# EAGLE board serv_open8_rohm (EAGLE 9.6.2), part 1 of 2
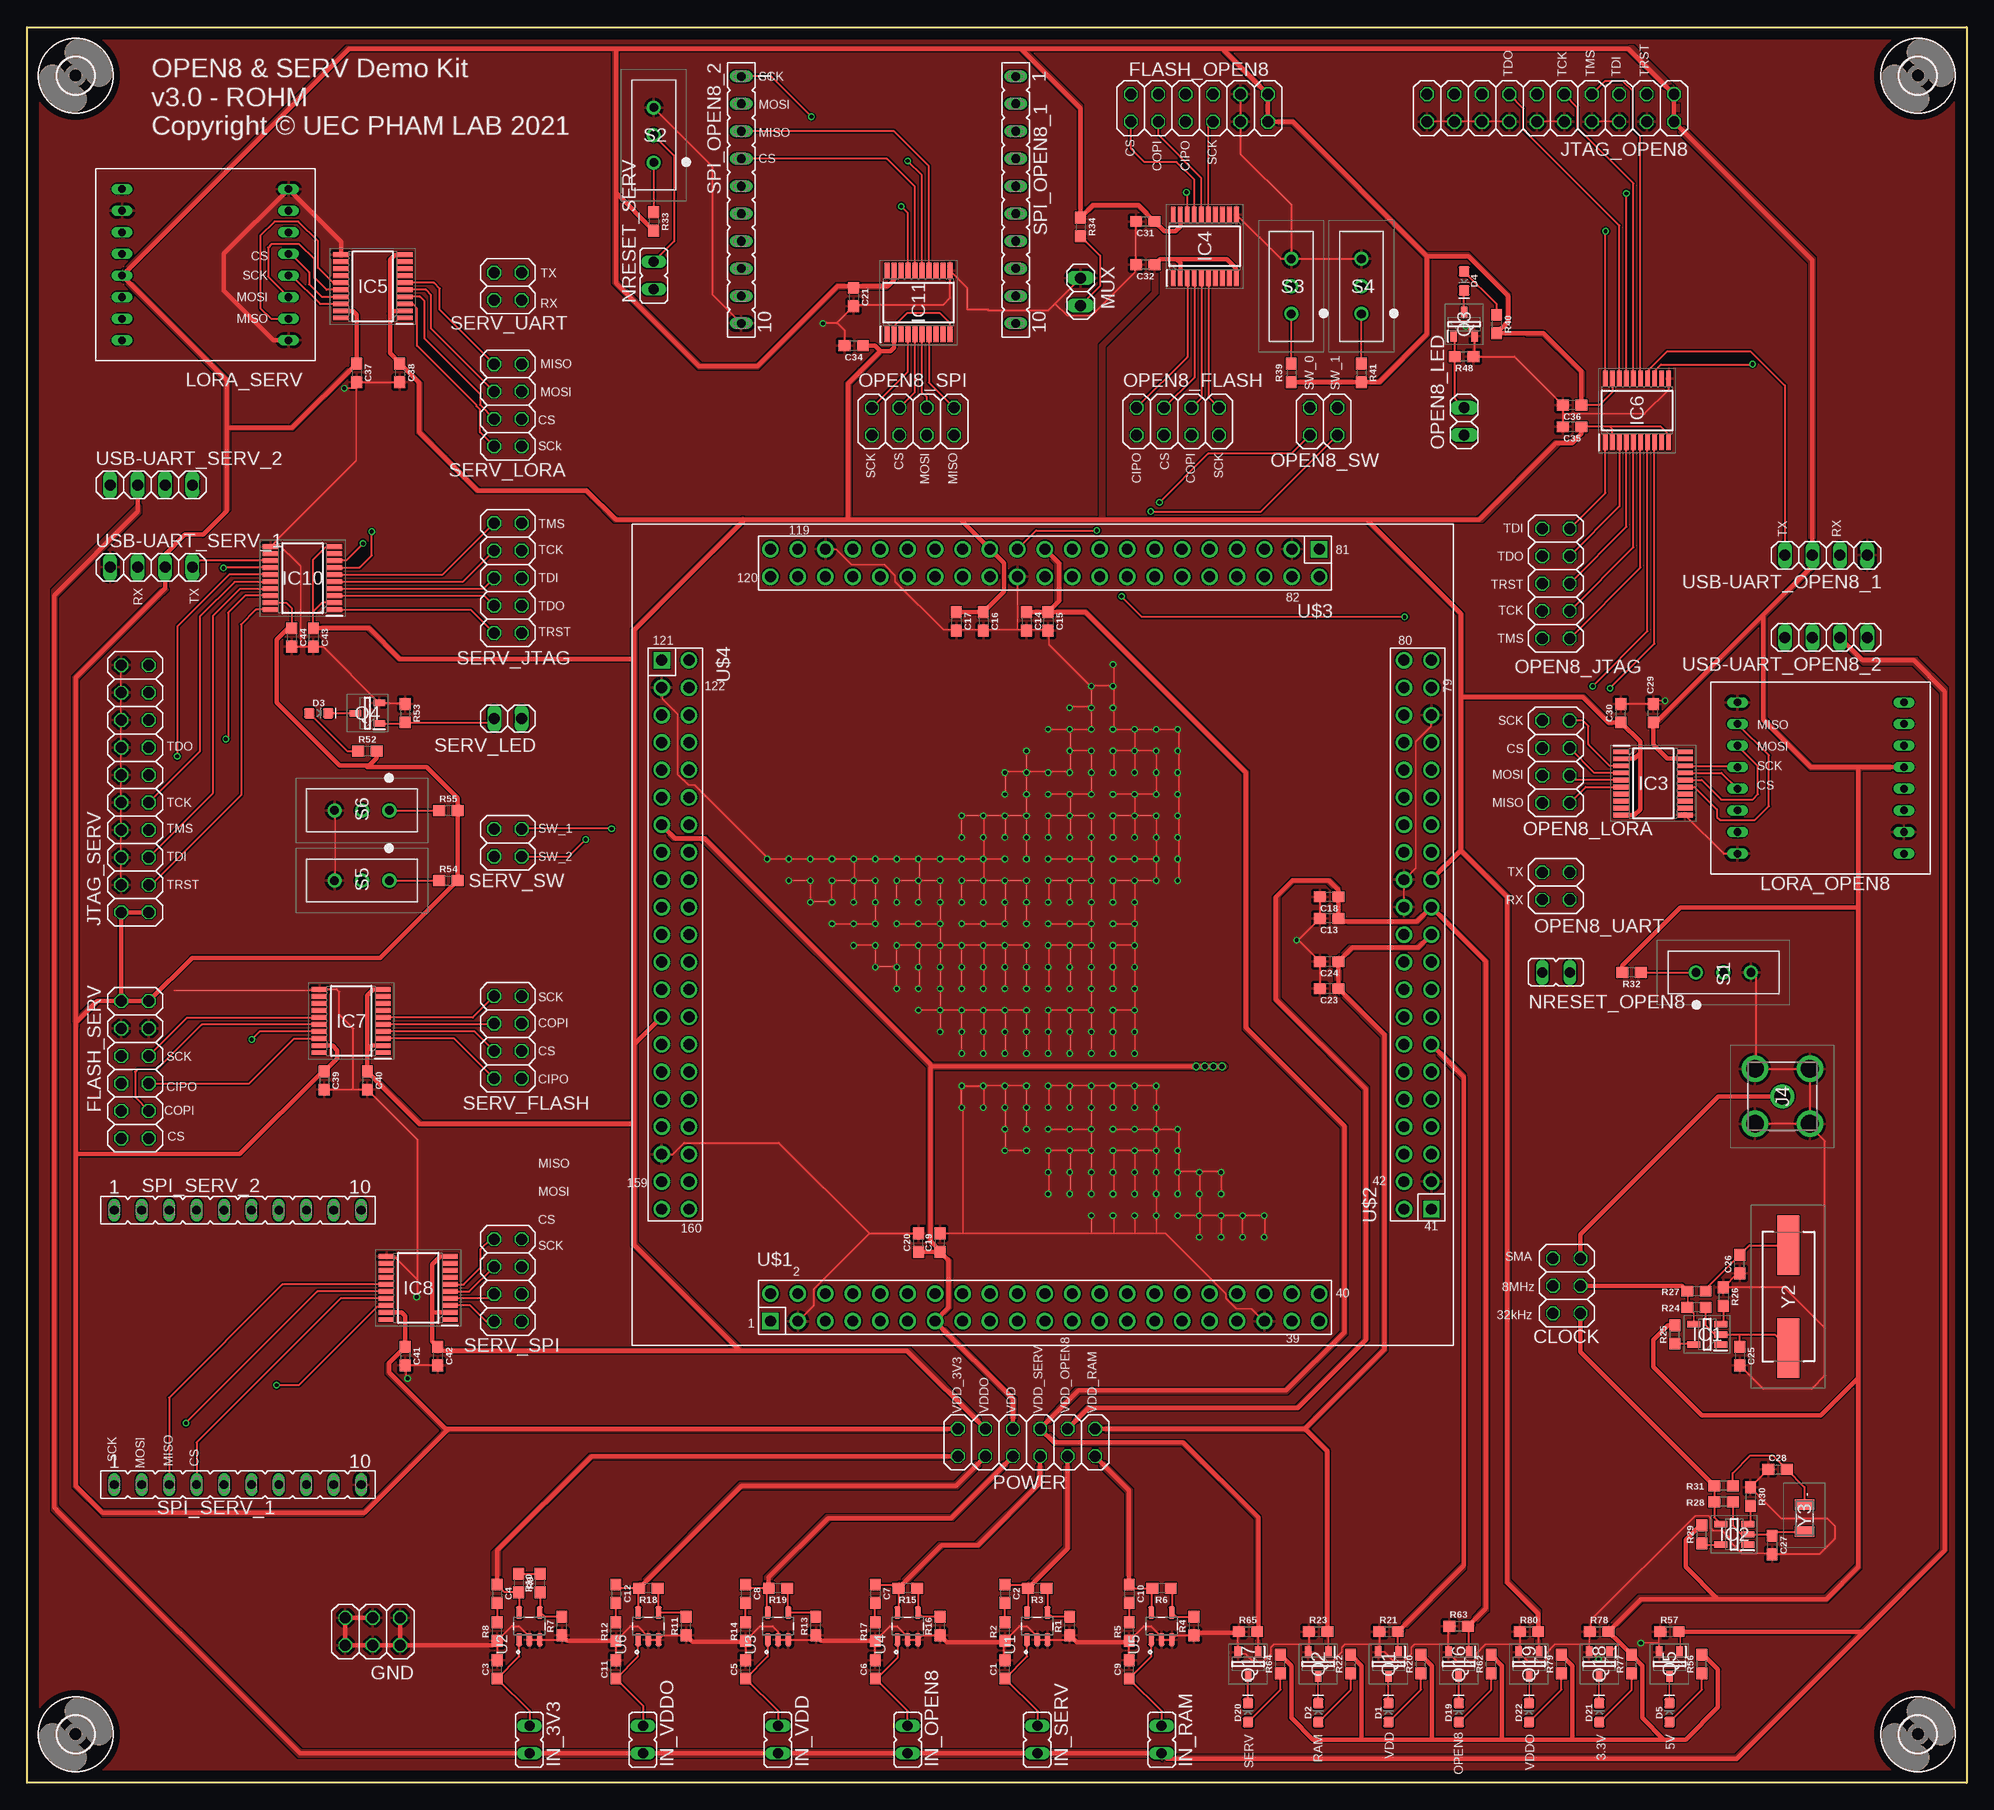
[diagram p7: board, top side]
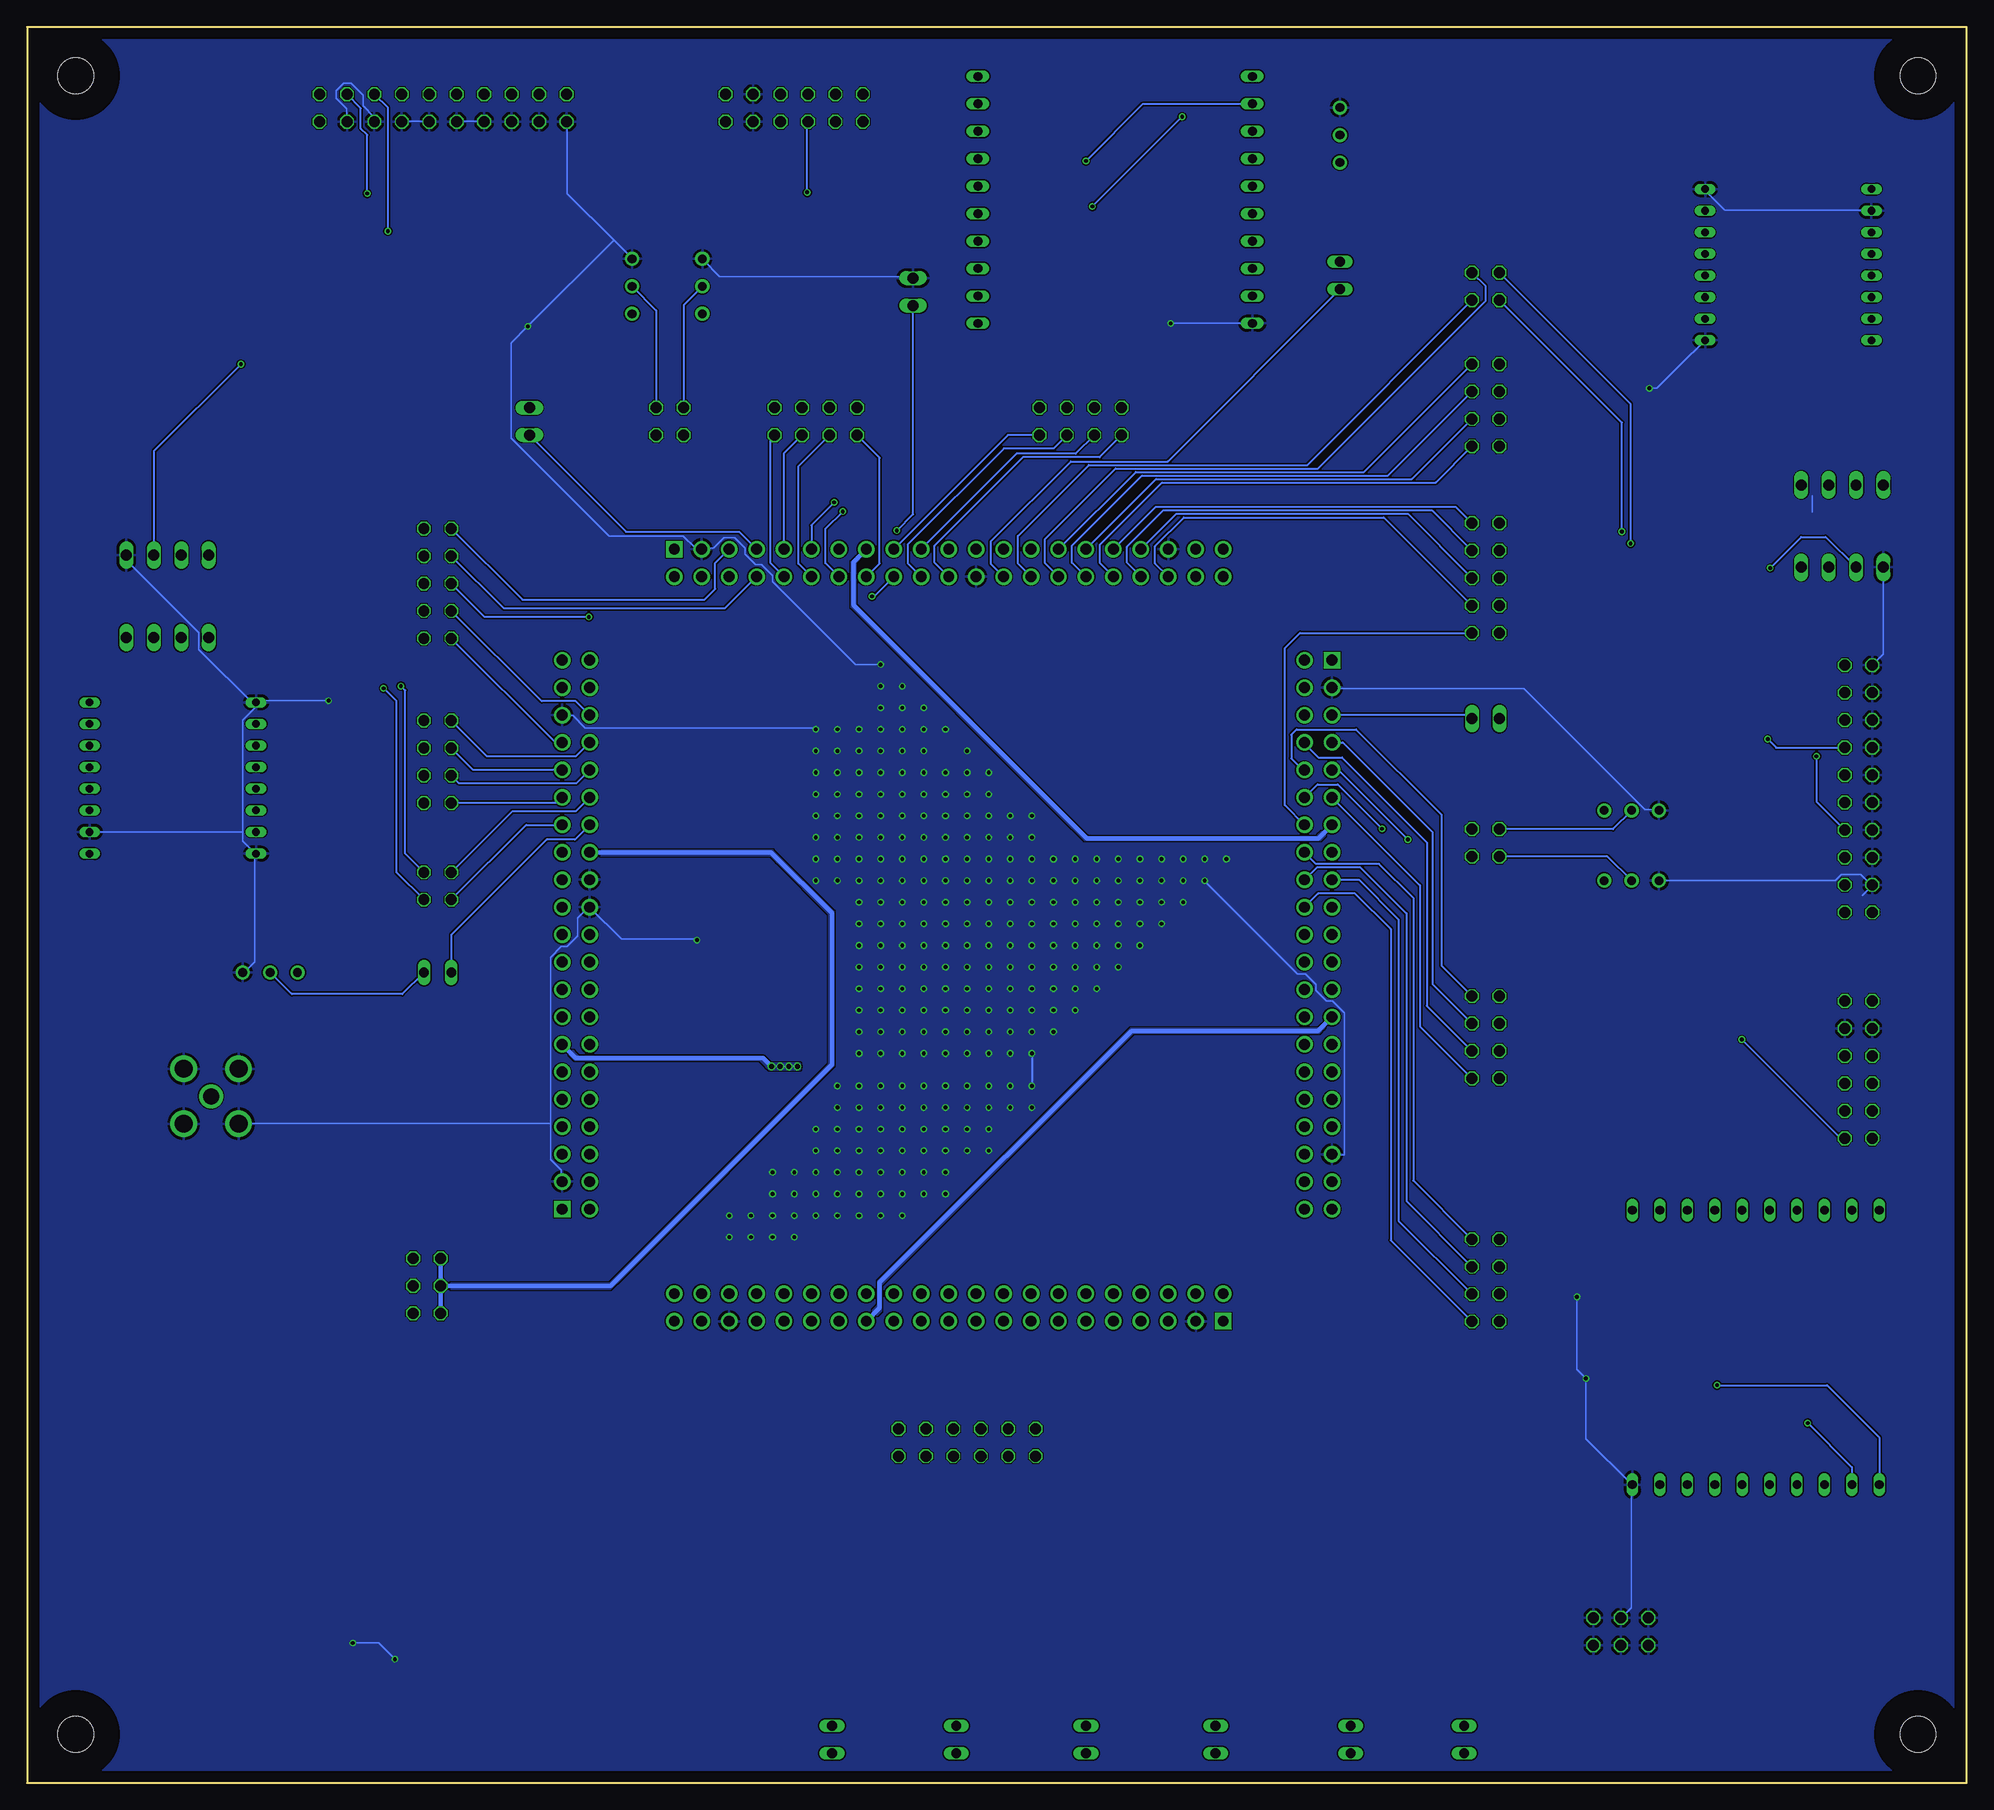
[diagram p8: board, bottom side, seen from below]

Size 179.5 x 162.5 mm. Coordinates in mm from the lower left corner, seen from the top.
Outline: 0,162.5 179.5,162.5 179.5,0 0,0 0,162.5
Copper layers (1*16): Top 0.035mm / dielectric 1.5mm / Bottom 0.035mm
Design rules "default *": minimum track width 6mil, minimum drill 0.35mm, track to track 5mil, track to pad 0.2mm, pad to pad 5mil, via to via 10mil, smd to smd 10mil, copper to edge 40mil, drill to drill 6mil, minimum pad ring 0.13mm, minimum via ring 0.13mm, stop-mask expansion 4mil, vias tented up to drill 0mil, thermal gap 10mil

## Footprints (pad centres in the part's own frame; a part is rotated, then mirrored left to right if it is on the bottom)
0603 = smd 1.1 x 1: 1 -0.85,0; 2 0.85,0
2X03 = drill 1.016 octagon: 1 -2.54,-1.27; 2 -2.54,1.27; 3 0,-1.27; 4 0,1.27; 5 2.54,-1.27; 6 2.54,1.27
LED-0603 = smd 1 x 1: A -0.877,0; C 0.877,0
2X06 = drill 1.016 octagon: 1 -6.35,-1.27; 2 -6.35,1.27; 3 -3.81,-1.27; 4 -3.81,1.27; 5 -1.27,-1.27; 6 -1.27,1.27; 7 1.27,-1.27; 8 1.27,1.27; 9 3.81,-1.27; 10 3.81,1.27; 11 6.35,-1.27; 12 6.35,1.27
3,3 = hole 3.3: 0,0
SOT95P280X145-5N = smd 1.2 x 0.6: 1 -1.25,0.95; 2 -1.25,0; 3 -1.25,-0.95; 4 1.25,-0.95; 5 1.25,0.95
SOP65P640X120-20N = smd 1.475 x 0.45: 1 -2.938,2.925; 2 -2.938,2.275; 3 -2.938,1.625; 4 -2.938,0.975; 5 -2.938,0.325; 6 -2.938,-0.325; 7 -2.938,-0.975; 8 -2.938,-1.625; 9 -2.938,-2.275; 10 -2.938,-2.925; 11 2.938,-2.925; 12 2.938,-2.275; 13 2.938,-1.625; 14 2.938,-0.975; 15 2.938,-0.325; 16 2.938,0.325; 17 2.938,0.975; 18 2.938,1.625; 19 2.938,2.275; 20 2.938,2.925
JP1 = drill 0.914 long: 1 0,-1.27; 2 0,1.27
29856004 = drill 1.64 pad 2.46: 1 0,0; 2 5.08,0; 3 5.08,5.08; 4 0,5.08 | drill 1.47 pad 2.205: 5 2.54,2.54
2X10 = drill 1.016 octagon: 1 -11.43,-1.27; 2 -11.43,1.27; 3 -8.89,-1.27; 4 -8.89,1.27; 5 -6.35,-1.27; 6 -6.35,1.27; 7 -3.81,-1.27; 8 -3.81,1.27; 9 -1.27,-1.27; 10 -1.27,1.27; 11 1.27,-1.27; 12 1.27,1.27; 13 3.81,-1.27; 14 3.81,1.27; 15 6.35,-1.27; 16 6.35,1.27; 17 8.89,-1.27; 18 8.89,1.27; 19 11.43,-1.27; 20 11.43,1.27
RFM95-915S2 = drill 0.7 pad 0.7 long: P$1 -7.7,7; P$2 -7.7,5; P$3 -7.7,3; P$4 -7.7,1; P$5 -7.7,-1; P$6 -7.7,-3; P$7 -7.7,-5; P$8 -7.7,-7; P$9 7.7,7; P$10 7.7,5; P$11 7.7,3; P$12 7.7,1; P$13 7.7,-1; P$14 7.7,-3; P$15 7.7,-5; P$16 7.7,-7
1X02 = drill 1.016 long: 1 -1.27,0; 2 1.27,0
2X04 = drill 1.016 octagon: 1 -3.81,-1.27; 2 -3.81,1.27; 3 -1.27,-1.27; 4 -1.27,1.27; 5 1.27,-1.27; 6 1.27,1.27; 7 3.81,-1.27; 8 3.81,1.27
2X05 = drill 1.016 octagon: 1 -5.08,-1.27; 2 -5.08,1.27; 3 -2.54,-1.27; 4 -2.54,1.27; 5 0,-1.27; 6 0,1.27; 7 2.54,-1.27; 8 2.54,1.27; 9 5.08,-1.27; 10 5.08,1.27
2X02 = drill 1.016 octagon: 1 -1.27,-1.27; 2 -1.27,1.27; 3 1.27,-1.27; 4 1.27,1.27
SOT95P230X110-3N = smd 1.05 x 0.6: 1 -1.1,0.95; 2 -1.1,-0.95; 3 1.1,0
SS12SDP2 = drill 0.8 pad 1.3: 1 0,2.54; 2 0,0; 3 0,-2.54
FE10 = drill 0.813 long: 1 -11.43,0; 2 -8.89,0; 3 -6.35,0; 4 -3.81,0; 5 -1.27,0; 6 1.27,0; 7 3.81,0; 8 6.35,0; 9 8.89,0; 10 11.43,0
SOT95P280X145-5N' = smd 1.21 x 0.59: 1 -1.255,0.95; 2 -1.255,0; 3 -1.255,-0.95; 4 1.255,-0.95; 5 1.255,0.95
2X41_HEADER = drill 1 pad 1.524 square: 1 -25.4,-1.27 | drill 1 pad 1.524: 2 -25.4,1.27; 3 -22.86,-1.27; 4 -22.86,1.27; 5 -20.32,-1.27; 6 -20.32,1.27; 7 -17.78,-1.27; 8 -17.78,1.27; 9 -15.24,-1.27; 10 -15.24,1.27; 11 -12.7,-1.27; 12 -12.7,1.27; 13 -10.16,-1.27; 14 -10.16,1.27; 15 -7.62,-1.27; 16 -7.62,1.27; 17 -5.08,-1.27; 18 -5.08,1.27; 19 -2.54,-1.27; 20 -2.54,1.27; 21 0,-1.27; 22 0,1.27; 23 2.54,-1.27; 24 2.54,1.27; 25 5.08,-1.27; 26 5.08,1.27; 27 7.62,-1.27; 28 7.62,1.27; 29 10.16,-1.27; 30 10.16,1.27; 31 12.7,-1.27; 32 12.7,1.27; 33 15.24,-1.27; 34 15.24,1.27; 35 17.78,-1.27; 36 17.78,1.27; 37 20.32,-1.27; 38 20.32,1.27; 39 22.86,-1.27; 40 22.86,1.27; 41 25.4,-1.27; 42 25.4,1.27
1X04 = drill 1.016 long: 1 -3.81,0; 2 -1.27,0; 3 1.27,0; 4 3.81,0
HC49SM8MHZ20PF30PPM = smd 5.5 x 2: 1 -4.75,0; 2 4.75,0
Q13FC1350000400 = smd 1 x 1.8: 1 -1.25,0; 2 1.25,0

## Placement (x,y rotation side)
C1  1.0uF  [0603]  90.5,10.5 90 top
C2  4.7uF  [0603]  90.5,17.5 270 top
C3  1.0uF  [0603]  43.5,10.5 90 top
C4  4.7uF  [0603]  43.5,17.5 270 top
C5  1.0uF  [0603]  66.5,10.5 90 top
C6  1.0uF  [0603]  78.5,10.5 90 top
C7  4.7uF  [0603]  78.5,17.5 270 top
C8  4.7uF  [0603]  66.5,17.5 270 top
C9  1.0uF  [0603]  102,10.5 90 top
C10  4.7uF  [0603]  102,17.5 270 top
C11  1.0uF  [0603]  54.5,10.5 90 top
C12  4.7uF  [0603]  54.5,17.5 270 top
C13  0.1uF  [0603]  120.5,80 180 top
C14  0.1uF  [0603]  92.5,107.5 270 top
C15  10uF  [0603]  94.5,107.5 270 top
C16  0.1uF  [0603]  88.5,107.5 270 top
C17  10uF  [0603]  86,107.5 270 top
C18  10uF  [0603]  120.5,82 180 top
C19  0.1uF  [0603]  84.5,50 90 top
C20  10uF  [0603]  82.5,50 90 top
C21  0.1uF  [0603]  76.5,137.5 270 top
C23  0.1uF  [0603]  120.5,73.5 180 top
C24  10uF  [0603]  120.5,76 180 top
C25  36pF  [0603]  158.5,39.5 270 top
C26  36pF  [0603]  158.5,48 90 top
C27  22pF  [0603]  161.5,22 270 top
C28  22pF  [0603]  162,29 0 top
C29  0.1uF  [0603]  150.5,99 90 top
C30  0.1uF  [0603]  147.5,99 90 top
C31  0.1uF  [0603]  103.5,144.5 180 top
C32  0.1uF  [0603]  103.5,140.5 180 top
C34  0.1uF  [0603]  76.5,133 180 top
C35  0.1uF  [0603]  143,125.5 180 top
C36  0.1uF  [0603]  143,127.5 180 top
C37  0.1uF  [0603]  30.5,130.5 270 top
C38  0.1uF  [0603]  34.5,130.5 270 top
C39  0.1uF  [0603]  27.5,65 270 top
C40  0.1uF  [0603]  31.5,65 270 top
C41  0.1uF  [0603]  35,39.5 270 top
C42  0.1uF  [0603]  38,39.5 270 top
C43  0.1uF  [0603]  26.5,106 270 top
C44  0.1uF  [0603]  24.5,106 270 top
CLOCK  PINHD-2X3  [2X03]  142.5,46 90 top
D1  LED0  [LED-0603]  126,6.5 90 top
D2  LED0  [LED-0603]  119.5,6.5 90 top
D3  LED0  [LED-0603]  27,99 0 top
D4  LED0  [LED-0603]  133,139 270 top
D5  LED0  [LED-0603]  152,6.5 90 top
D19  LED0  [LED-0603]  132.5,6.5 90 top
D20  LED0  [LED-0603]  113,6.5 90 top
D21  LED0  [LED-0603]  145.5,6.5 90 top
D22  LED0  [LED-0603]  139,6.5 90 top
FLASH_OPEN8  PINHD-2X6  [2X06]  108.5,155 180 top
FLASH_SERV  PINHD-2X6  [2X06]  10,66 270 top
GND  PINHD-2X3  [2X03]  32,14 180 top
H1  MOUNT-HOLE3.3  [3,3]  4.5,158 0 top
H2  MOUNT-HOLE3.3  [3,3]  4.5,4.5 0 top
H3  MOUNT-HOLE3.3  [3,3]  175,158 0 top
H4  MOUNT-HOLE3.3  [3,3]  175,4.5 0 top
IC1  SN74LVC1GU04DBVR  [SOT95P280X145-5N]  155.5,41.5 180 top
IC2  SN74LVC1GU04DBVR  [SOT95P280X145-5N]  158,23 180 top
IC3  TXB0108PWR  [SOP65P640X120-20N]  150.5,92.5 0 top
IC4  TXB0108PWR  [SOP65P640X120-20N]  109,142.2 90 top
IC5  TXB0108PWR  [SOP65P640X120-20N]  32,138.5 180 top
IC6  TXB0108PWR  [SOP65P640X120-20N]  149,127 90 top
IC7  TXB0108PWR  [SOP65P640X120-20N]  30,70.5 180 top
IC8  TXB0108PWR  [SOP65P640X120-20N]  36.2,45.8 180 top
IC10  TXB0108PWR  [SOP65P640X120-20N]  25.5,111.5 180 top
IC11  TXB0108PWR  [SOP65P640X120-20N]  82.5,137 90 top
IN_3V3  REG_IN_IO  [JP1]  46.5,4 0 top
IN_OPEN8  REG_IN_OPEN8  [JP1]  81.5,4 0 top
IN_RAM  REG_IN_OPEN8  [JP1]  105,4 0 top
IN_SERV  REG_IN_SERV  [JP1]  93.5,4 0 top
IN_VDD  REG_IN  [JP1]  69.5,4 0 top
IN_VDDO  REG_IN_SERV  [JP1]  57,4 0 top
J4  2985-6004  [29856004]  165,61 90 top
JTAG_OPEN8  [2X10]  141,155 180 top
JTAG_SERV  [2X10]  10,92 90 top
LORA_OPEN8  [RFM95-915S2]  166,93 0 top
LORA_SERV  [RFM95-915S2]  16.5,140.5 180 top
MUX  [1X02]  97.5,138 90 top
NRESET_OPEN8  REG_IN  [JP1]  141.5,75 270 top
NRESET_SERV  REG_IN  [JP1]  58,139.5 0 top
OPEN8_FLASH  [2X04]  106.5,126 0 top
OPEN8_JTAG  PINHD-2X5  [2X05]  141.5,111 270 top
OPEN8_LED  PINHD-1X2  [1X02]  133,126 90 top
OPEN8_LORA  [2X04]  141.5,94.5 270 top
OPEN8_SPI  [2X04]  82,126 0 top
OPEN8_SW  PINHD-2X2  [2X02]  120,126 0 top
OPEN8_UART  PINHD-2X2  [2X02]  141.5,83 270 top
POWER  [2X06]  92.5,31.5 0 top
Q1  BSH103,235  [SOT95P230X110-3N]  126,11 270 top
Q2  BSH103,235  [SOT95P230X110-3N]  119.5,11 270 top
Q3  BSH103,235  [SOT95P230X110-3N]  133,135 90 top
Q4  BSH103,235  [SOT95P230X110-3N]  31.5,99 180 top
Q5  BSH103,235  [SOT95P230X110-3N]  152,11 270 top
Q16  BSH103,235  [SOT95P230X110-3N]  132.5,11 270 top
Q17  BSH103,235  [SOT95P230X110-3N]  113,11 270 top
Q18  BSH103,235  [SOT95P230X110-3N]  145.5,11 270 top
Q19  BSH103,235  [SOT95P230X110-3N]  139,11 270 top
R1  66.5KOHM-0603-1/10W-5%  [0603]  96.5,14.5 90 top
R2  1  [0603]  90.5,14 90 top
R3  113k  [0603]  93.5,18 180 top
R4  66.5KOHM-0603-1/10W-5%  [0603]  108,14.5 90 top
R5  1  [0603]  102,14 90 top
R6  113k  [0603]  105,18 180 top
R7  66.5KOHM-0603-1/10W-5%  [0603]  49.5,14.5 90 top
R8  1  [0603]  43.5,14 90 top
R9  3k  [0603]  45.5,18.5 270 top
R10  243k  [0603]  47.5,18.5 90 top
R11  66.5KOHM-0603-1/10W-5%  [0603]  61,14.5 90 top
R12  1  [0603]  54.5,14 90 top
R13  66.5KOHM-0603-1/10W-5%  [0603]  73,14.5 90 top
R14  1  [0603]  66.5,14 90 top
R15  113k  [0603]  81.5,18 180 top
R16  66.5KOHM-0603-1/10W-5%  [0603]  84.5,14.5 90 top
R17  1  [0603]  78.5,14 90 top
R18  113k  [0603]  57.5,18 180 top
R19  113k  [0603]  69.5,18 180 top
R20  330  [0603]  129,11 90 top
R21  10k  [0603]  126,14 0 top
R22  330  [0603]  122.5,11 90 top
R23  10k  [0603]  119.5,14 0 top
R24  10M  [0603]  154.5,44 180 top
R25  47k  [0603]  152.5,41.5 90 top
R26  47k  [0603]  157,45 270 top
R27  2k  [0603]  154.5,45.5 180 top
R28  10M  [0603]  157,26 180 top
R29  47k  [0603]  155,23 90 top
R30  47k  [0603]  159.5,26.5 270 top
R31  300k  [0603]  157,27.5 180 top
R32  10k  [0603]  148.5,75 180 top
R33  10k  [0603]  58,144.5 270 top
R34  10k  [0603]  97.5,144 270 top
R39  10k  [0603]  117,130.5 270 top
R40  330  [0603]  136,135 270 top
R41  10k  [0603]  123.5,130.5 270 top
R48  10k  [0603]  133,132 180 top
R52  330  [0603]  31.5,95.5 0 top
R53  10k  [0603]  35,99 270 top
R54  10k  [0603]  39,83.5 0 top
R55  10k  [0603]  39,90 0 top
R56  330  [0603]  155,11 90 top
R57  10k  [0603]  152,14 0 top
R62  330  [0603]  135.5,11 90 top
R63  10k  [0603]  132.5,14.5 0 top
R64  330  [0603]  116,11 90 top
R65  10k  [0603]  113,14 0 top
R77  330  [0603]  148.5,11 90 top
R78  10k  [0603]  145.5,14 0 top
R79  330  [0603]  142,11 90 top
R80  10k  [0603]  139,14 0 top
S1  SS12SDP2  [SS12SDP2]  157,75 90 top
S2  SS12SDP2  [SS12SDP2]  58,152.5 180 top
S3  SS12SDP2  [SS12SDP2]  117,138.5 180 top
S4  SS12SDP2  [SS12SDP2]  123.5,138.5 180 top
S5  SS12SDP2  [SS12SDP2]  31,83.5 270 top
S6  SS12SDP2  [SS12SDP2]  31,90 270 top
SERV_FLASH  [2X04]  44.5,69 90 top
SERV_JTAG  PINHD-2X5  [2X05]  44.5,111.5 90 top
SERV_LED  PINHD-1X2  [1X02]  44.5,98.5 180 top
SERV_LORA  [2X04]  44.5,127.5 90 top
SERV_SPI  [2X04]  44.5,46.5 90 top
SERV_SW  PINHD-2X2  [2X02]  44.5,87 90 top
SERV_UART  PINHD-2X2  [2X02]  44.5,138.5 90 top
SPI_OPEN8_1  SPI1  [FE10]  91.5,146.5 270 top
SPI_OPEN8_2  SPI0  [FE10]  66.1,146.5 270 top
SPI_SERV_1  SPI0  [FE10]  19.5,27.6 0 top
SPI_SERV_2  SPI1  [FE10]  19.5,53 0 top
U1  TPS76201DBVR  [SOT95P280X145-5N']  93.5,14.5 90 top
U2  TPS76201DBVR  [SOT95P280X145-5N']  46.5,14.5 90 top
U3  TPS76201DBVR  [SOT95P280X145-5N']  69.5,14.5 90 top
U4  TPS76201DBVR  [SOT95P280X145-5N']  81.5,14.5 90 top
U5  TPS76201DBVR  [SOT95P280X145-5N']  105,14.5 90 top
U6  TPS76201DBVR  [SOT95P280X145-5N']  57.5,14.5 90 top
U$1  [2X41_HEADER]  94.2,44 0 top
U$2  [2X41_HEADER]  128.7,78.5 90 top
U$3  [2X41_HEADER]  94.2,112.9 180 top
U$4  [2X41_HEADER]  60,78.5 270 top
USB-UART_OPEN8_1  PINHD-1X4  [1X04]  166.5,113.62 180 top
USB-UART_OPEN8_2  PINHD-1X4  [1X04]  166.5,106 180 top
USB-UART_SERV_1  PINHD-1X4  [1X04]  11.5,112.5 0 top
USB-UART_SERV_2  PINHD-1X4  [1X04]  11.5,120.12 0 top
Y2  HC-49SM8MHZ20PF30PPM  [HC49SM8MHZ20PF30PPM]  163,45 270 top
Y3  Q13FC1350000400  [Q13FC1350000400]  164.5,24.5 270 top